# EAGLE design HBridge84 (EAGLE 7.5.0)
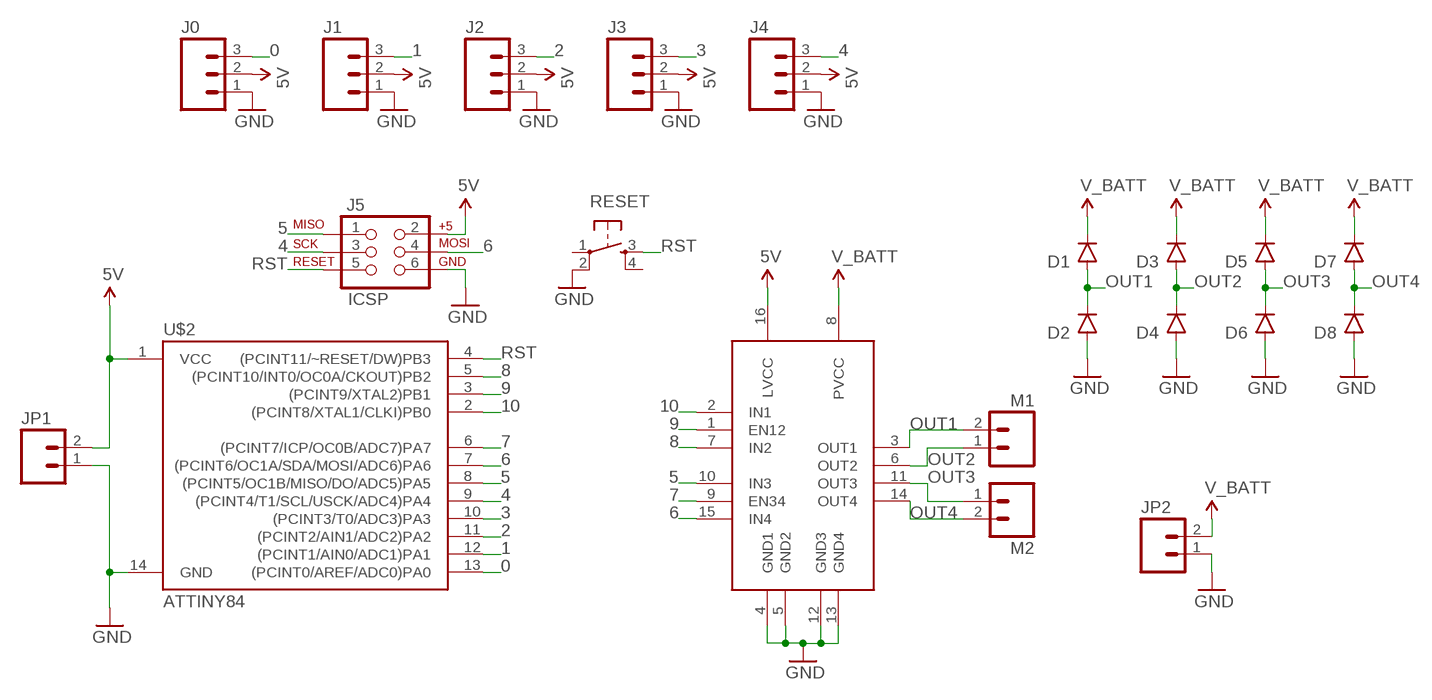
[diagram p0: schematic, sheet 1]

## Parts
D1  DIODEPTH  [DIODE-1N4001]
D2  DIODEPTH  [DIODE-1N4001]
D3  DIODEPTH  [DIODE-1N4001]
D4  DIODEPTH  [DIODE-1N4001]
D5  DIODEPTH  [DIODE-1N4001]
D6  DIODEPTH  [DIODE-1N4001]
D7  DIODEPTH  [DIODE-1N4001]
D8  DIODEPTH  [DIODE-1N4001]
J0  M03PTH  [1X03]
J1  M03PTH  [1X03]
J2  M03PTH  [1X03]
J3  M03PTH  [1X03]
J4  M03PTH  [1X03]
J5  ICSP  AVR_SPI_PRG_6LABELED  [2X3-NS]
JP1  M02PTH  [1X02]
JP2  M02PTH  [1X02]
M1  M02PTH  [1X02]
M2  M02PTH  [1X02]
RESET  TAC_SWITCHPTH  [TACTILE-PTH]
SN754410  SN754410  [DIP16]
U$2  ATTINY84  ATTINY84ATTINY84-20PU  [DIL14]

## Nets
0: J0.3 U$2.13((PCINT0/AREF/ADC0)PA0)
1: J1.3 U$2.12((PCINT1/AIN0/ADC1)PA1)
2: J2.3 U$2.11((PCINT2/AIN1/ADC2)PA2)
3: J3.3 U$2.10((PCINT3/T0/ADC3)PA3)
4: J4.3 J5.3(SCK) U$2.9((PCINT4/T1/SCL/USCK/ADC4)PA4)
5: J5.1(MISO) SN754410.10(IN3) U$2.8((PCINT5/OC1B/MISO/DO/ADC5)PA5)
5V: J0.2 J1.2 J2.2 J3.2 J4.2 J5.2(V+) JP1.2 SN754410.16(LVCC) U$2.1(VCC)
6: J5.4(MOSI) SN754410.15(IN4) U$2.7((PCINT6/OC1A/SDA/MOSI/ADC6)PA6)
7: SN754410.9(EN34) U$2.6((PCINT7/ICP/OC0B/ADC7)PA7)
8: SN754410.7(IN2) U$2.5((PCINT10/INT0/OC0A/CKOUT)PB2)
9: SN754410.1(EN12) U$2.3((PCINT9/XTAL2)PB1)
10: SN754410.2(IN1) U$2.2((PCINT8/XTAL1/CLKI)PB0)
GND: D2.A D4.A D6.A D8.A J0.1 J1.1 J2.1 J3.1 J4.1 J5.6(GND) JP1.1 JP2.1 RESET.2 SN754410.4(GND1) SN754410.5(GND2) SN754410.12(GND3) SN754410.13(GND4) U$2.14(GND)
OUT1: D1.A D2.C M1.2 SN754410.3(OUT1)
OUT2: D3.A D4.C M1.1 SN754410.6(OUT2)
OUT3: D5.A D6.C M2.1 SN754410.11(OUT3)
OUT4: D7.A D8.C M2.2 SN754410.14(OUT4)
RST: J5.5(RST) RESET.3 U$2.4((PCINT11/~RESET/DW)PB3)
V_BATT: D1.C D3.C D5.C D7.C JP2.2 SN754410.8(PVCC)
Unconnected: RESET.1 RESET.4

## Library data of the parts
D1-D8 = SparkFun-DiscreteSemi:DIODE: Diode These are standard reverse protection diodes and small signal diodes. SMA package can handle up to about 1A. SOD-323 can handle about 200mA. What the SOD-323 package when ordering, there are some mfgs out there that are 5-pin packages.
J0 J1-J4 = SparkFun-Connectors:M03: Header 3 Standard 3-pin 0.1" header. Use with straight break away headers (SKU : PRT-00116), right angle break away headers (PRT-00553), swiss pins (PRT-00743), machine pins (PRT-00117), and female headers (PRT-00115). Molex polarized connector foot print use with SKU : PRT-08232 with associated crimp pins and housings.
J5 = barbary_enterprises:AVR_SPI_PRG_6: AVR ISP 6 Pin This is the reduced ISP connector for AVR programming. Common on Arduino. This footprint will take up less PCB space and can be used with a 10-pin to 6-pin adapter such as SKU: BOB-08508
JP1 JP2 M1 M2 = SparkFun-Connectors:M02: Standard 2-pin 0.1" header. Use with - straight break away headers ( PRT-00116) - right angle break away headers (PRT-00553) - swiss pins (PRT-00743) - machine pins (PRT-00117) - female headers (PRT-00115) Molex polarized connector foot print use with: PRT-08233 with associated crimp pins and housings. 2.54_SCREWTERM for use with PRT-10571. 3.5mm Screw Terminal footprints for PRT-08084 5mm Screw Terminal footprints for use with PRT-08432
RESET = barbary_enterprises:TAC_SWITCH: Momentary Switch Button commonly used for reset or general input. Spark Fun Electronics SKU : COM-00097 SMT- SWCH-08247
SN754410 = barbary_enterprises:SN754410
U$2 = AtmelAvr:ATTINY84: Atmel 14-pin 2/4/8kB flash uC

## Board
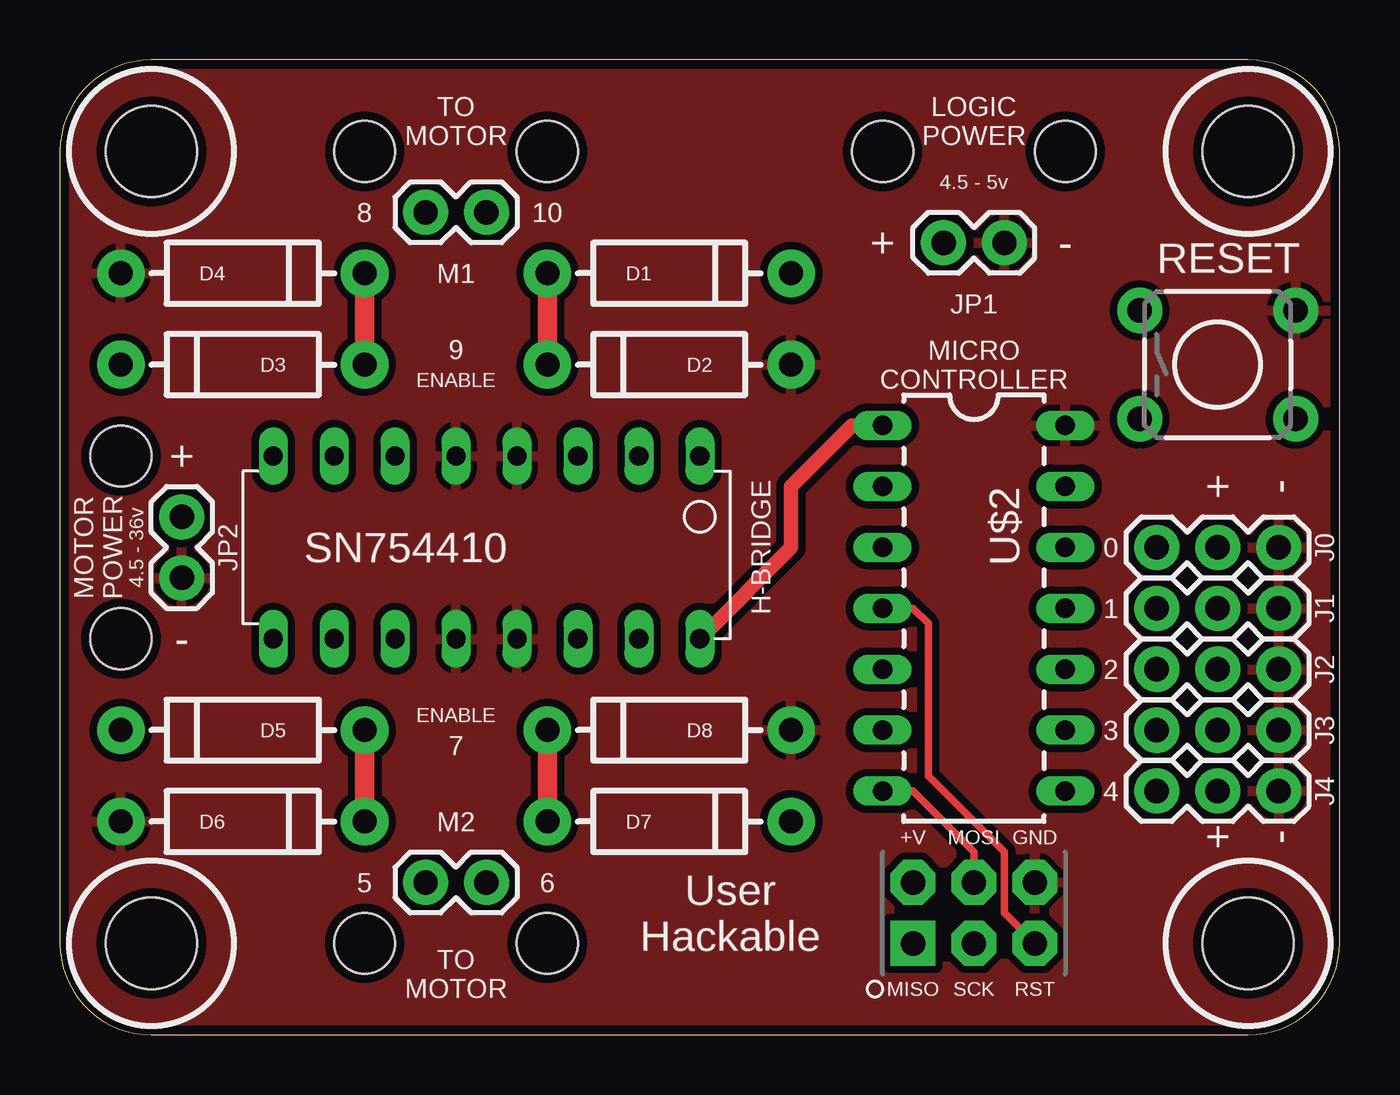
[diagram p1: board, top side]
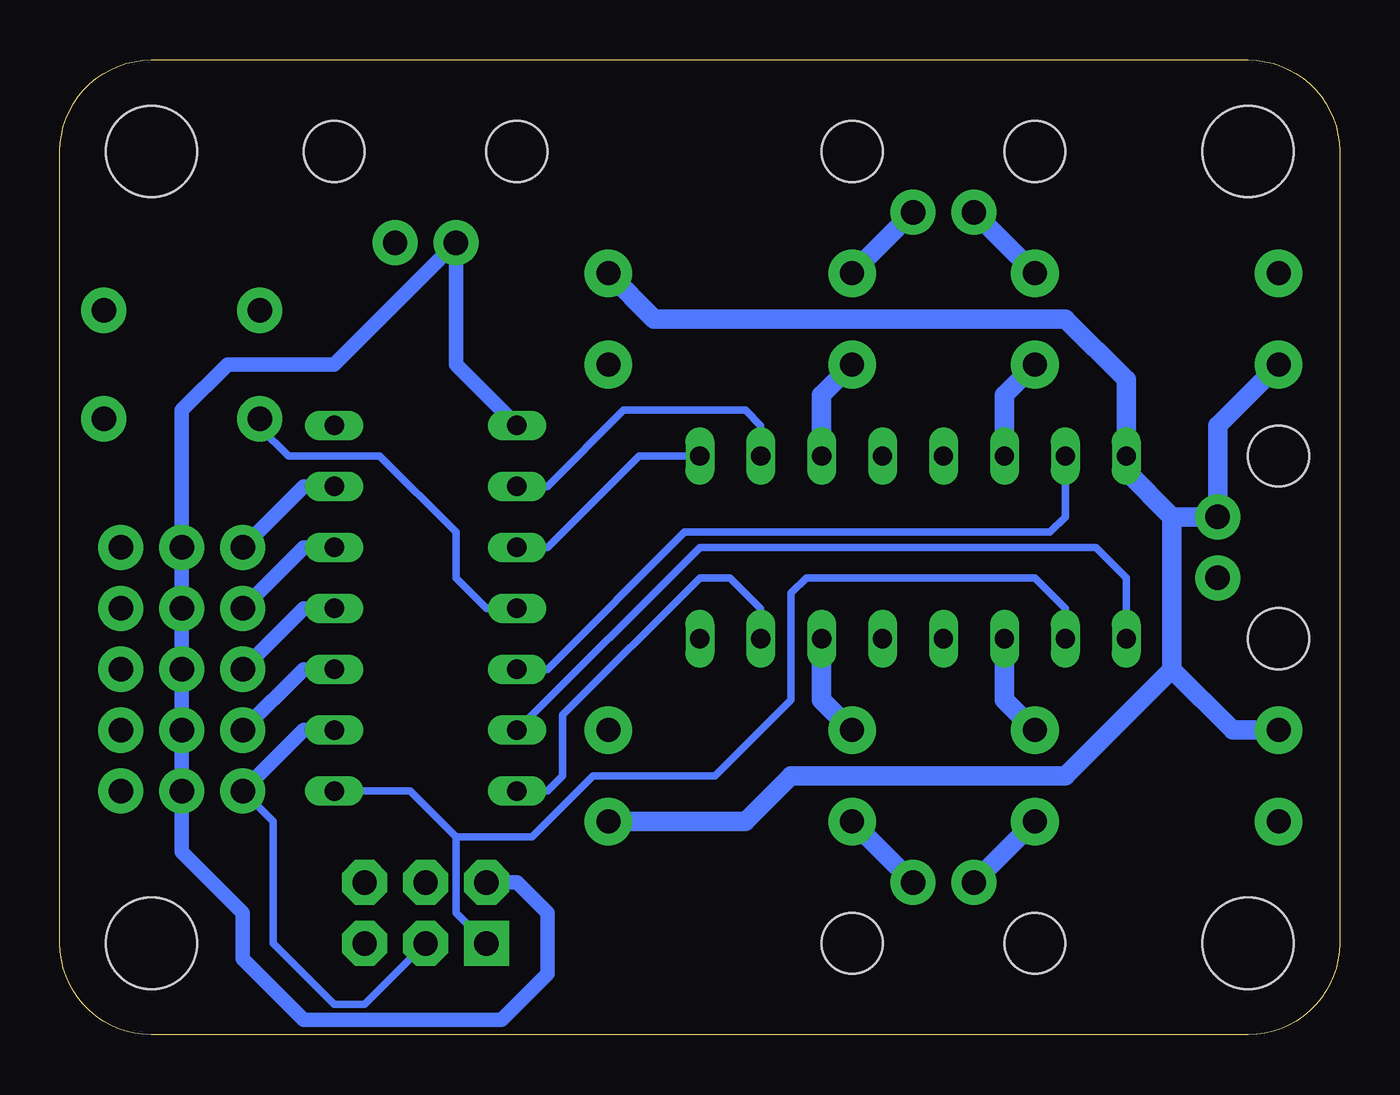
[diagram p2: board, bottom side, seen from below]

Size 53.34 x 40.64 mm. Coordinates in mm from the lower left corner, seen from the top.
Outline: 3.81,0 49.53,0 arc90 53.34,3.81 53.34,36.83 arc90 49.53,40.64 3.81,40.64 arc90 0,36.83 0,3.81 arc90 3.81,0
Copper layers (1*16): Top 0.0356mm / dielectric 1.5011mm / Bottom 0.0356mm
Design rules "LaenPCBOrder": minimum track width 6mil, minimum drill 13mil, track to track 6mil, track to pad 6mil, pad to pad 6mil, via to via 6mil, smd to smd 6mil, copper to edge 15mil, drill to drill 6mil, minimum pad ring 7mil, minimum via ring 7mil, stop-mask expansion 3mil, vias tented up to drill 0mil, thermal gap 10mil
Holes 3.81 mm at 3.81,36.83 3.81,3.81 49.53,36.83 49.53,3.81
Holes 2.54 mm at 12.7,3.81 20.32,3.81 12.7,36.83 20.32,36.83 2.54,16.51 2.54,24.13 34.29,36.83 41.91,36.83

### Footprints (pad centres in the part's own frame; a part is rotated, then mirrored left to right if it is on the bottom)
DIODE-1N4001 = drill 1 pad 1.981: A -5.08,0; C 5.08,0
1X03 = drill 1.016 pad 1.88: 1 0,0; 2 2.54,0; 3 5.08,0
2X3-NS = drill 1.016 pad 1.88 square: 1 -2.54,-1.27 | drill 1.016 pad 1.88 octagon: 2 -2.54,1.27; 3 0,-1.27; 4 0,1.27; 5 2.54,-1.27; 6 2.54,1.27
1X02 = drill 1.016 pad 1.88: 1 0,0; 2 2.54,0
TACTILE-PTH = drill 1.016 pad 1.88: 1 -3.251,2.261; 2 3.251,2.261; 3 -3.251,-2.261; 4 3.251,-2.261
DIP16 = drill 0.8 long: 1 -3.81,8.89; 2 -3.81,6.35; 3 -3.81,3.81; 4 -3.81,1.27; 5 -3.81,-1.27; 6 -3.81,-3.81; 7 -3.81,-6.35; 8 -3.81,-8.89; 9 3.81,-8.89; 10 3.81,-6.35; 11 3.81,-3.81; 12 3.81,-1.27; 13 3.81,1.27; 14 3.81,3.81; 15 3.81,6.35; 16 3.81,8.89
DIL14 = drill 0.813 long: 1 -8.89,-3.81; 2 -6.35,-3.81; 3 -3.81,-3.81; 4 -1.27,-3.81; 5 1.27,-3.81; 6 3.81,-3.81; 7 6.35,-3.81; 8 6.35,3.81; 9 3.81,3.81; 10 1.27,3.81; 11 -1.27,3.81; 12 -3.81,3.81; 13 -6.35,3.81; 14 -8.89,3.81

### Placement (x,y rotation side)
D1  25.4,31.75 0 top
D2  25.4,27.94 180 top
D3  7.62,27.94 180 top
D4  7.62,31.75 0 top
D5  7.62,12.7 180 top
D6  7.62,8.89 0 top
D7  25.4,8.89 0 top
D8  25.4,12.7 180 top
J0  50.8,20.32 180 top
J1  50.8,17.78 180 top
J2  50.8,15.24 180 top
J3  50.8,12.7 180 top
J4  50.8,10.16 180 top
J5  38.1,5.08 0 top
JP1  39.37,33.02 180 top
JP2  5.08,19.05 90 top
M1  15.24,34.29 0 top
M2  15.24,6.35 0 top
RESET  48.26,27.94 0 top
SN754410  17.78,20.32 270 top
U$2  38.1,16.51 270 top

### Tracks (layer width: path | path; a pad name or v marks a point on that pad's centre or on a via)
0
  Bottom 0.61: U$2.13 43.18,22.86 J0.3
1
  Bottom 0.61: U$2.12 43.18,20.32 J1.3
2
  Bottom 0.61: U$2.11 43.18,17.78 J2.3
3
  Bottom 0.61: U$2.10 43.18,15.24 J3.3
4
  Bottom 0.305: J5.3 40.64,1.27 41.91,1.27 44.45,3.81 44.45,8.89 J4.3
  Bottom 0.61: U$2.9 43.18,12.7 J4.3
5
  Bottom 0.305: SN754410.10 11.43,17.78 12.7,19.05 22.23,19.05 22.86,18.41 22.86,13.97 26.04,10.79 31.11,10.79 33.66,8.26 36.83,8.26 | 36.83,8.26 38.73,10.16 U$2.8 | J5.1 36.83,5.08 36.83,8.26
5V
  Top 0.61: U$2.1 33.02,25.4 30.48,22.86 30.48,20.32 SN754410.16
  Bottom 0.61: J5.2 34.29,6.35 33.02,5.08 33.02,2.54 34.92,0.64 43.18,0.64 45.72,3.17 45.72,5.08 48.26,7.62 J4.2 J3.2 J2.2 J1.2 J0.2 48.26,26.04 46.35,27.94 41.91,27.94 JP1.2 36.83,27.94 U$2.1
6
  Top 0.305: J5.4 38.1,7.62 35.56,10.16 U$2.7
  Bottom 0.305: SN754410.15 24.13,17.78 25.4,19.05 26.67,19.05 32.38,13.34 32.38,10.79 33.02,10.16 U$2.7
7
  Bottom 0.305: SN754410.9 8.89,19.05 10.16,20.32 26.67,20.32 U$2.6
8
  Bottom 0.305: SN754410.7 11.43,21.59 12.06,20.95 27.3,20.95 33.02,15.24 U$2.5
9
  Bottom 0.305: SN754410.1 29.21,24.13 33.02,20.32 U$2.3
10
  Bottom 0.305: SN754410.2 24.13,25.4 24.77,26.04 29.84,26.04 33.02,22.86 U$2.2
GND
  pour Top (isolate 0.305): 0,0 53.34,0 53.34,40.64 0,40.64
OUT1
  Top 0.813: D2.C D1.A
  Bottom 0.813: SN754410.3 21.59,26.67 D2.C | D1.A M1.2
OUT2
  Top 0.813: D3.A D4.C
  Bottom 0.813: SN754410.6 13.97,26.67 D3.A | M1.1 D4.C
OUT3
  Top 0.813: D5.A D6.C
  Bottom 0.813: SN754410.11 13.97,13.97 D5.A | D6.C M2.1
OUT4
  Top 0.813: D8.C D7.A
  Bottom 0.813: SN754410.14 21.59,13.97 D8.C | M2.2 D7.A
RST
  Top 0.305: J5.5 39.37,5.08 39.37,7.62 36.2,10.79 36.2,17.14 35.56,17.78 U$2.4
  Bottom 0.305: RESET.3 45.01,25.32 43.81,24.13 40.01,24.13 36.83,20.95 36.83,19.05 35.56,17.78 U$2.4
V_BATT
  Bottom 0.813: 6.99,21.59 JP2.2 5.08,25.4 D3.C | 6.99,21.59 8.89,23.5 SN754410.8 8.89,27.3 11.43,29.84 28.57,29.84 D1.C | D5.C 4.45,12.7 6.99,15.24 | 6.99,15.24 6.99,21.59 | 6.99,15.24 11.43,10.79 22.86,10.79 24.77,8.89 D7.C

### Text on the board
tPlace: TO / MOTOR | LOGIC / POWER | 4.5 - 5v | 8 | 10 | + | - | 9 | MICRO / CONTROLLER | ENABLE | + | + | - | MOTOR / POWER | 4.5 - 36v | H-BRIDGE | 0 | 1 | - | 2 | ENABLE | 3 | 7 | 4 | + | - | 5 | 6 | User / Hackable | TO / MOTOR